# EAGLE board linuxstamp_2_103 (EAGLE 5.06), part 1 of 2
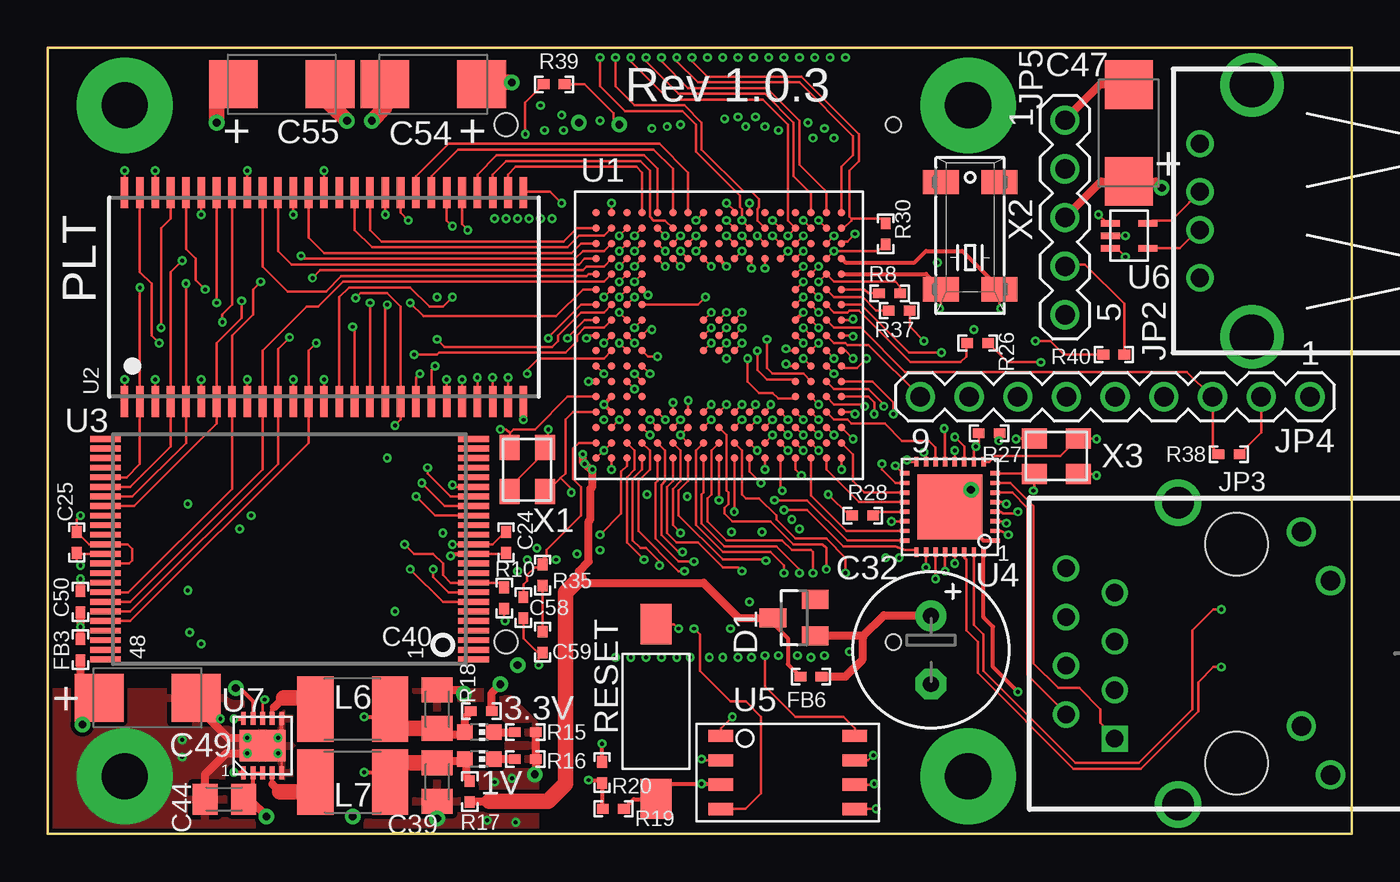
[diagram p2: board, top side]
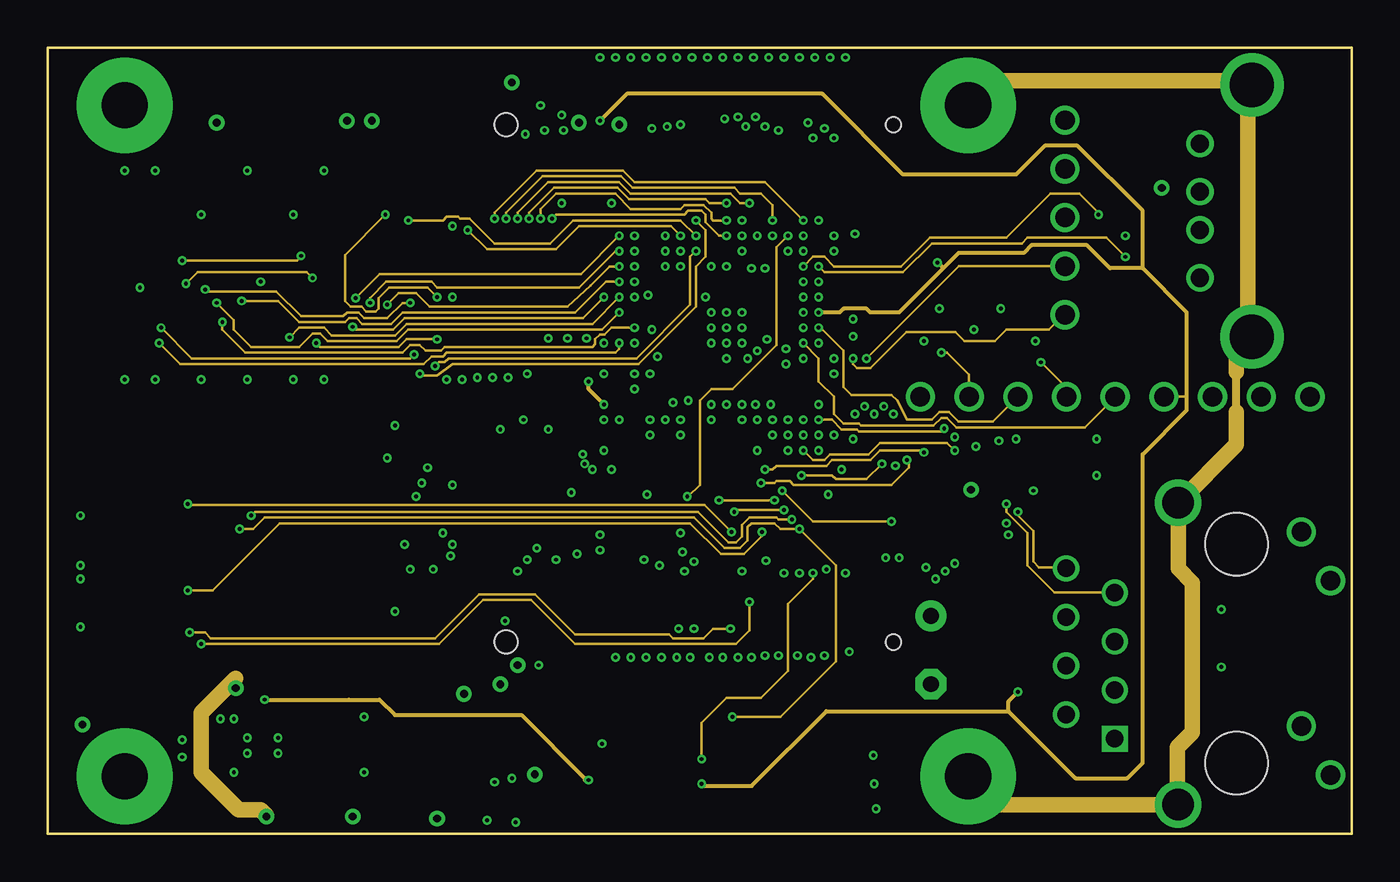
[diagram p3: board, inner layer Route2]
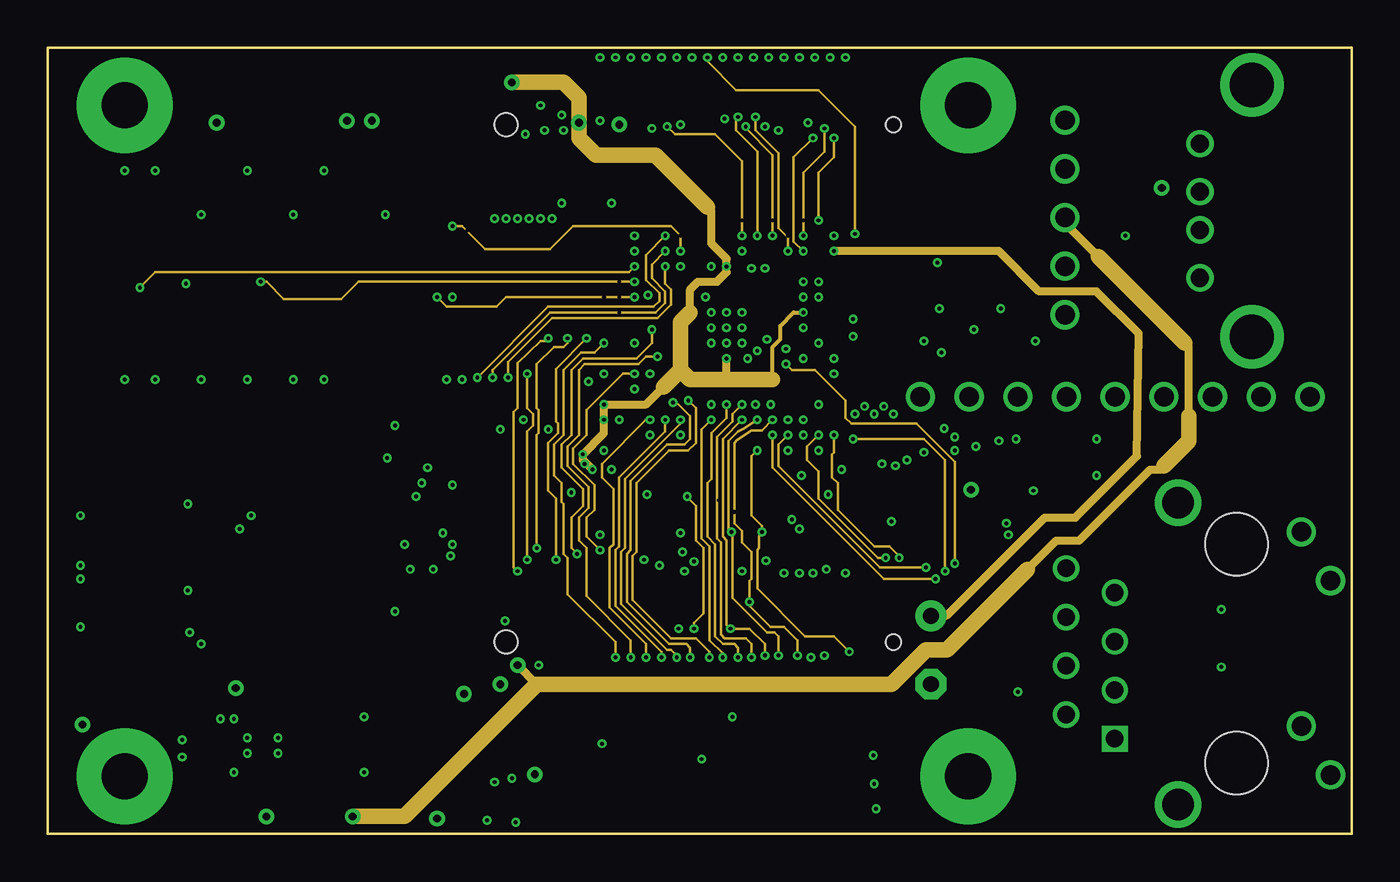
[diagram p4: board, inner layer Route3]
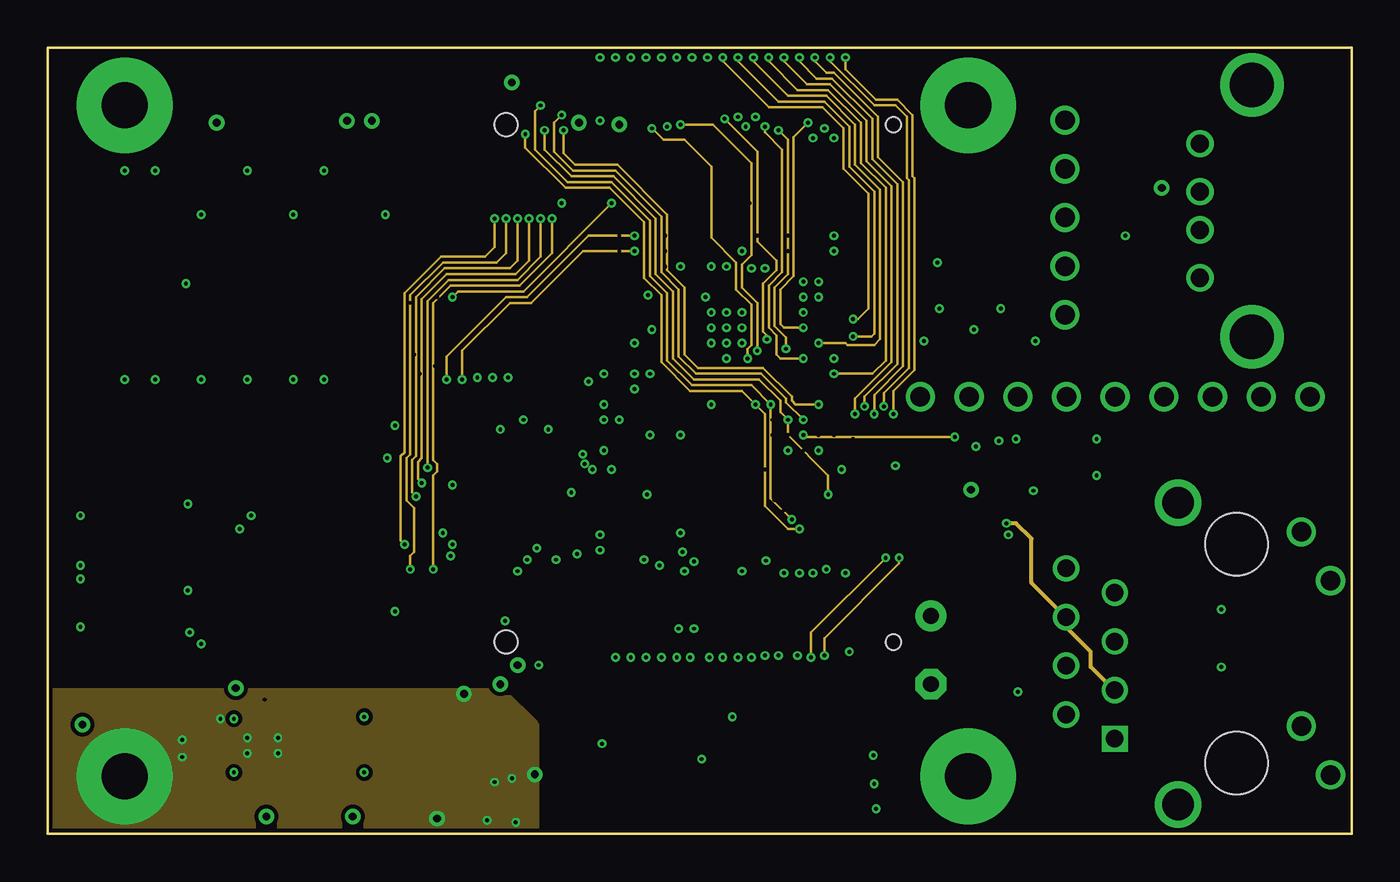
[diagram p5: board, inner layer Route14]
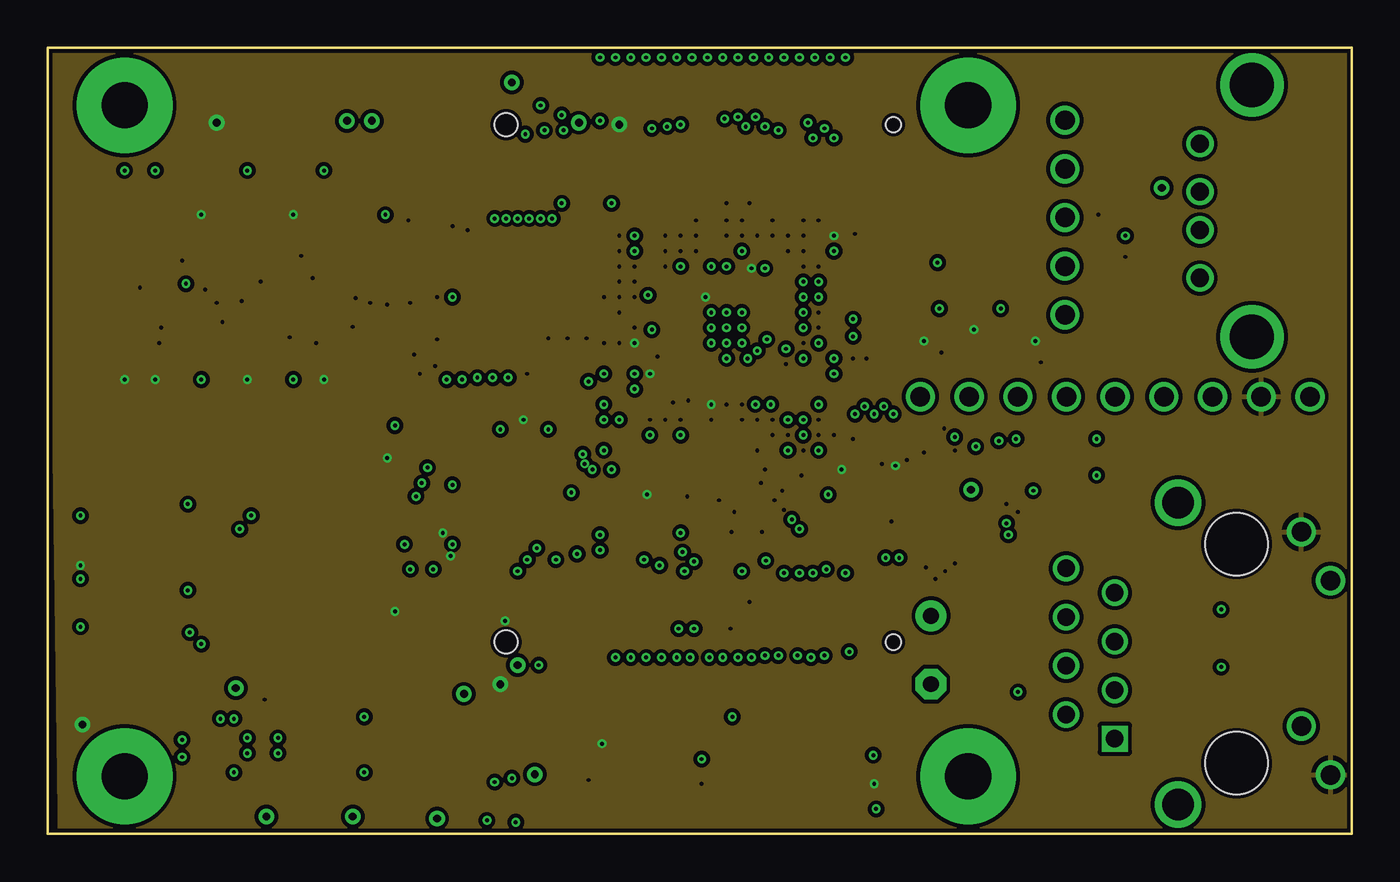
[diagram p6: board, inner layer Route15]
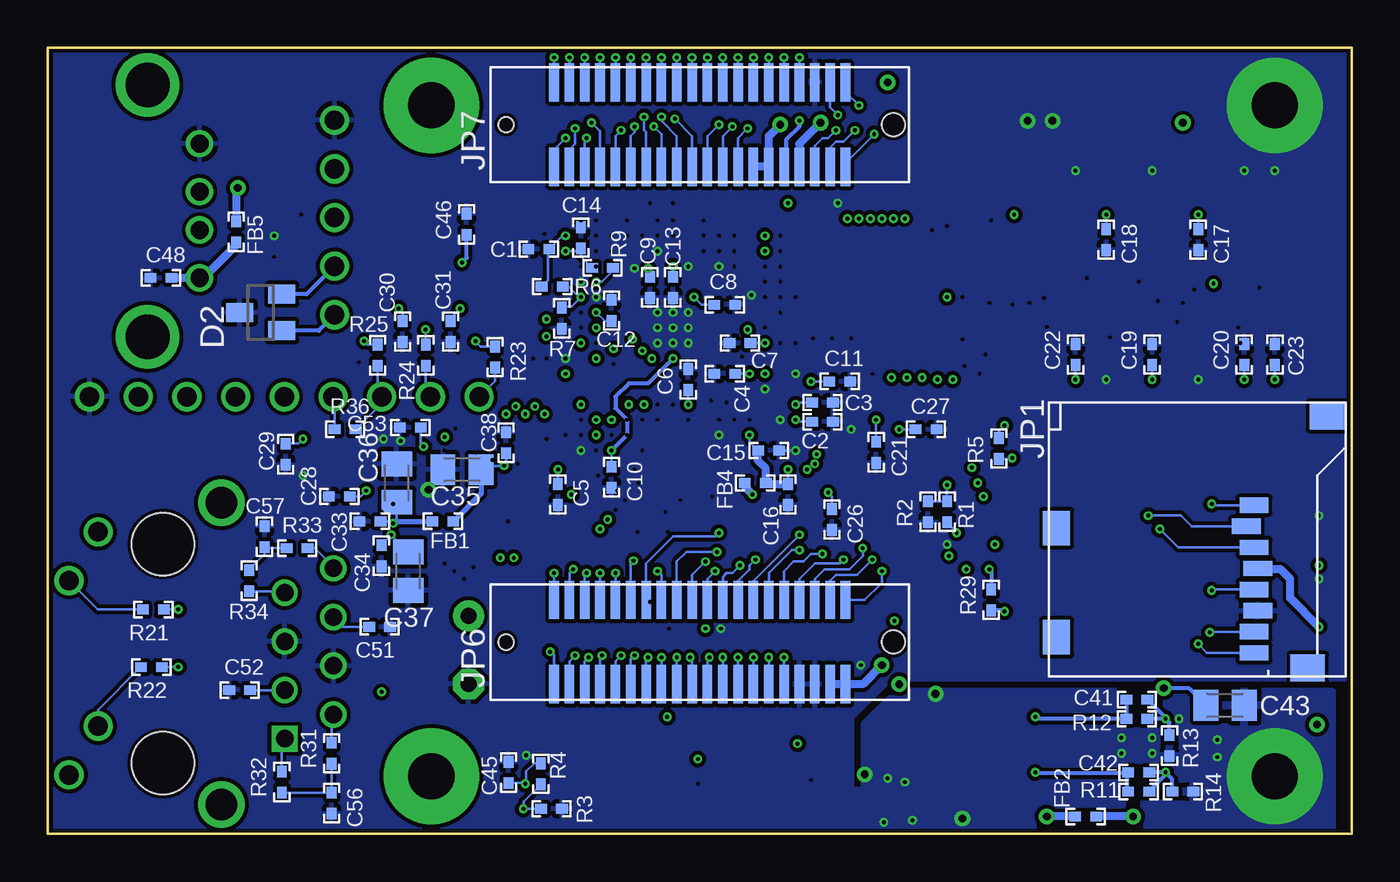
[diagram p7: board, bottom side, seen from below]

Size 68 x 41 mm. Coordinates in mm from the lower left corner, seen from the top.
Outline: 0,0 0,41 68,41 68,0 0,0
Copper layers ([3:1*2*3*14*15*16]): Top 0.035mm / dielectric 0.3048mm / Route2 0.035mm / dielectric 0.3048mm / Route3 0.035mm / dielectric 0.3048mm / Route14 0.035mm / dielectric 0.3048mm / Route15 0.035mm / dielectric 0.3048mm / Bottom 0.035mm
Design rules "default *": minimum track width 5mil, minimum drill 5mil, track to track 5mil, track to pad 5mil, pad to pad 5mil, via to via 5mil, smd to smd 0mil, copper to edge 8mil, drill to drill 8mil, minimum pad ring 5mil, minimum via ring 5mil, stop-mask expansion 2mil, vias tented up to drill 9mil, thermal gap 10mil

## Footprints (pad centres in the part's own frame; a part is rotated, then mirrored left to right if it is on the bottom)
CHIP-LED0603 = smd 0.8 x 0.8: A 0,-0.75; C 0,0.75
0402 = smd 0.61 x 0.51: 1 -0.55,0; 2 0.55,0
E3,5-8 = drill 0.813 pad 1.6 round: + -1.778,0 | drill 0.813 pad 1.6 octagon: - 1.778,0
C0805K = smd 1.3 x 1.6: 1 -1,0; 2 1,0
C/6032-28R = smd 2.55 x 2.5: + 2.525,0; - -2.525,0
SOT23 = smd 1 x 1.4: 1 -0.95,-1.1; 2 0.95,-1.1; 3 0,1.1
CON-MICRO-SD = smd 0.8 x 1.5: 1 5.36,10.7; 2 6.46,10.3; 3 7.56,10.7; 4 8.66,10.9; 5 9.76,10.7; 6 10.86,10.9; 7 11.96,10.7; 8 13.06,10.7 | smd 1.4 x 1.8: M1 0.7,14.5; M2 13.85,13.5 | smd 1.8 x 1.4: M3 12.25,0.4; M4 6.55,0.4
PN87520 = drill 0.95 round: 1 -3.5,2.71; 2 -1,2.71; 3 1,2.71; 4 3.5,2.71 | drill 2.3 round: G1 -6.57,0; G2 6.57,0
PJ-J0 = drill 0.914 square: 1 4.445,-6.35 | drill 0.914 round: 2 3.175,-8.89; 3 1.905,-6.35; 4 0.635,-8.89; 5 -0.635,-6.35; 6 -1.905,-8.89; 7 -3.175,-6.35; 8 -4.445,-8.89 | drill 1.016 round: 9 6.325,4.902; 10 3.785,3.378; 11 -3.81,4.902; 12 -6.35,3.378 | drill 1.626 round: S1 -7.874,-3.048; S2 7.874,-3.048 | hole 3.251: -5.715,0; 5.715,0
MA09-1 = drill 1.016 round: 1 -10.16,0; 2 -7.62,0; 3 -5.08,0; 4 -2.54,0; 5 0,0; 6 2.54,0; 7 5.08,0; 8 7.62,0; 9 10.16,0
MA05-1 = drill 1.016 round: 1 -5.08,0; 2 -2.54,0; 3 0,0; 4 2.54,0; 5 5.08,0
CON-BERGSTACK-40 = smd 0.5 x 2: 1 -7.6,-2.2; 2 -6.8,-2.2; 3 -6,-2.2; 4 -5.2,-2.2; 5 -4.4,-2.2; 6 -3.6,-2.2; 7 -2.8,-2.2; 8 -2,-2.2; 9 -1.2,-2.2; 10 -0.4,-2.2; 11 0.4,-2.2; 12 1.2,-2.2; 13 2,-2.2; 14 2.8,-2.2; 15 3.6,-2.2; 16 4.4,-2.2; 17 5.2,-2.2; 18 6,-2.2; 19 6.8,-2.2; 20 7.6,-2.2; 21 7.6,2.2; 22 6.8,2.2; 23 6,2.2; 24 5.2,2.2; 25 4.4,2.2; 26 3.6,2.2; 27 2.8,2.2; 28 2,2.2; 29 1.2,2.2; 30 0.4,2.2; 31 -0.4,2.2; 32 -1.2,2.2; 33 -2,2.2; 34 -2.8,2.2; 35 -3.6,2.2; 36 -4.4,2.2; 37 -5.2,2.2; 38 -6,2.2; 39 -6.8,2.2; 40 -7.6,2.2 | hole 0.8: -10.1,0 | hole 1.2: 10.1,0
L1812 = smd 1.9 x 3.4: 1 -1.95,0; 2 1.95,0
SWITCH-6X3.5 = smd 2.1 x 1.6: 1 -4.55,0; 2 4.55,0
LFBGA-217 = smd 0.4 x 0.4: A1 -6.4,6.4; A2 -5.6,6.4; A3 -4.8,6.4; A4 -4,6.4; A5 -3.2,6.4; A6 -2.4,6.4; A7 -1.6,6.4; A8 -0.8,6.4; A9 0,6.4; A10 0.8,6.4; A11 1.6,6.4; A12 2.4,6.4; A13 3.2,6.4; A14 4,6.4; A15 4.8,6.4; A16 5.6,6.4; A17 6.4,6.4; B1 -6.4,5.6; B2 -5.6,5.6; B3 -4.8,5.6; B4 -4,5.6; B5 -3.2,5.6; B6 -2.4,5.6; B7 -1.6,5.6; B8 -0.8,5.6; B9 0,5.6; B10 0.8,5.6; B11 1.6,5.6; B12 2.4,5.6; B13 3.2,5.6; B14 4,5.6; B15 4.8,5.6; B16 5.6,5.6; B17 6.4,5.6; C1 -6.4,4.8; C2 -5.6,4.8; C3 -4.8,4.8; C4 -4,4.8; C5 -3.2,4.8; C6 -2.4,4.8; C7 -1.6,4.8; C8 -0.8,4.8; C9 0,4.8; C10 0.8,4.8; C11 1.6,4.8; C12 2.4,4.8; C13 3.2,4.8; C14 4,4.8; C15 4.8,4.8; C16 5.6,4.8; C17 6.4,4.8; D1 -6.4,4; D2 -5.6,4; D3 -4.8,4; D4 -4,4; D5 -3.2,4; D6 -2.4,4; D7 -1.6,4; D8 -0.8,4; D9 0,4; D10 0.8,4; D11 1.6,4; D12 2.4,4; D13 3.2,4; D14 4,4; D15 4.8,4; D16 5.6,4; D17 6.4,4; E1 -6.4,3.2; E2 -5.6,3.2; E3 -4.8,3.2; E4 -4,3.2; E14 4,3.2; E15 4.8,3.2; E16 5.6,3.2; E17 6.4,3.2; F1 -6.4,2.4; F2 -5.6,2.4; F3 -4.8,2.4; F4 -4,2.4; F14 4,2.4; F15 4.8,2.4; F16 5.6,2.4; F17 6.4,2.4; G1 -6.4,1.6; G2 -5.6,1.6; G3 -4.8,1.6; G4 -4,1.6; G14 4,1.6; G15 4.8,1.6; G16 5.6,1.6; G17 6.4,1.6; H1 -6.4,0.8; H2 -5.6,0.8; H3 -4.8,0.8; H4 -4,0.8; H8 -0.8,0.8; H9 0,0.8; H10 0.8,0.8; H14 4,0.8; H15 4.8,0.8; H16 5.6,0.8; H17 6.4,0.8; J1 -6.4,0; J2 -5.6,0; J3 -4.8,0; J4 -4,0; J8 -0.8,0; J9 0,0; J10 0.8,0; J14 4,0; J15 4.8,0; J16 5.6,0; J17 6.4,0; K1 -6.4,-0.8; K2 -5.6,-0.8; K3 -4.8,-0.8; K4 -4,-0.8; K8 -0.8,-0.8; K9 0,-0.8; K10 0.8,-0.8; K14 4,-0.8; K15 4.8,-0.8; K16 5.6,-0.8; K17 6.4,-0.8; L1 -6.4,-1.6; L2 -5.6,-1.6; L3 -4.8,-1.6; L4 -4,-1.6; L14 4,-1.6; L15 4.8,-1.6; L16 5.6,-1.6; L17 6.4,-1.6; M1 -6.4,-2.4; M2 -5.6,-2.4; M3 -4.8,-2.4; M4 -4,-2.4; M14 4,-2.4; M15 4.8,-2.4; M16 5.6,-2.4; M17 6.4,-2.4; N1 -6.4,-3.2; N2 -5.6,-3.2; N3 -4.8,-3.2; N4 -4,-3.2; N14 4,-3.2; N15 4.8,-3.2; N16 5.6,-3.2; N17 6.4,-3.2; P1 -6.4,-4; P2 -5.6,-4; P3 -4.8,-4; P4 -4,-4; P5 -3.2,-4; P6 -2.4,-4; P7 -1.6,-4; P8 -0.8,-4; P9 0,-4; P10 0.8,-4; P11 1.6,-4; P12 2.4,-4; P13 3.2,-4; P14 4,-4; P15 4.8,-4; P16 5.6,-4; P17 6.4,-4; R1 -6.4,-4.8; R2 -5.6,-4.8; R3 -4.8,-4.8; R4 -4,-4.8; R5 -3.2,-4.8; R6 -2.4,-4.8; R7 -1.6,-4.8; R8 -0.8,-4.8; R9 0,-4.8; R10 0.8,-4.8; R11 1.6,-4.8; R12 2.4,-4.8; R13 3.2,-4.8; R14 4,-4.8; R15 4.8,-4.8; R16 5.6,-4.8; R17 6.4,-4.8; T1 -6.4,-5.6; T2 -5.6,-5.6; T3 -4.8,-5.6; T4 -4,-5.6; T5 -3.2,-5.6; T6 -2.4,-5.6; T7 -1.6,-5.6; T8 -0.8,-5.6; T9 0,-5.6; T10 0.8,-5.6; T11 1.6,-5.6; T12 2.4,-5.6; T13 3.2,-5.6; T14 4,-5.6; T15 4.8,-5.6; T16 5.6,-5.6; T17 6.4,-5.6; U1 -6.4,-6.4; U2 -5.6,-6.4; U3 -4.8,-6.4; U4 -4,-6.4; U5 -3.2,-6.4; U6 -2.4,-6.4; U7 -1.6,-6.4; U8 -0.8,-6.4; U9 0,-6.4; U10 0.8,-6.4; U11 1.6,-6.4; U12 2.4,-6.4; U13 3.2,-6.4; U14 4,-6.4; U15 4.8,-6.4; U16 5.6,-6.4; U17 6.4,-6.4
TSOP54 = smd 0.4 x 1.6: 1 -10.4,-5.45; 2 -9.6,-5.45; 3 -8.8,-5.45; 4 -8,-5.45; 5 -7.2,-5.45; 6 -6.4,-5.45; 7 -5.6,-5.45; 8 -4.8,-5.45; 9 -4,-5.45; 10 -3.2,-5.45; 11 -2.4,-5.45; 12 -1.6,-5.45; 13 -0.8,-5.45; 14 0,-5.45; 15 0.8,-5.45; 16 1.6,-5.45; 17 2.4,-5.45; 18 3.2,-5.45; 19 4,-5.45; 20 4.8,-5.45; 21 5.6,-5.45; 22 6.4,-5.45; 23 7.2,-5.45; 24 8,-5.45; 25 8.8,-5.45; 26 9.6,-5.45; 27 10.4,-5.45; 28 10.4,5.45; 29 9.6,5.45; 30 8.8,5.45; 31 8,5.45; 32 7.2,5.45; 33 6.4,5.45; 34 5.6,5.45; 35 4.8,5.45; 36 4,5.45; 37 3.2,5.45; 38 2.4,5.45; 39 1.6,5.45; 40 0.8,5.45; 41 0,5.45; 42 -0.8,5.45; 43 -1.6,5.45; 44 -2.4,5.45; 45 -3.2,5.45; 46 -4,5.45; 47 -4.8,5.45; 48 -5.6,5.45; 49 -6.4,5.45; 50 -7.2,5.45; 51 -8,5.45; 52 -8.8,5.45; 53 -9.6,5.45; 54 -10.4,5.45
TSOP48 = smd 0.3 x 1.6: 1 -5.75,-9.6; 2 -5.25,-9.6; 3 -4.75,-9.6; 4 -4.25,-9.6; 5 -3.75,-9.6; 6 -3.25,-9.6; 7 -2.75,-9.6; 8 -2.25,-9.6; 9 -1.75,-9.6; 10 -1.25,-9.6; 11 -0.75,-9.6; 12 -0.25,-9.6; 13 0.25,-9.6; 14 0.75,-9.6; 15 1.25,-9.6; 16 1.75,-9.6; 17 2.25,-9.6; 18 2.75,-9.6; 19 3.25,-9.6; 20 3.75,-9.6; 21 4.25,-9.6; 22 4.75,-9.6; 23 5.25,-9.6; 24 5.75,-9.6; 25 5.75,9.6; 26 5.25,9.6; 27 4.75,9.6; 28 4.25,9.6; 29 3.75,9.6; 30 3.25,9.6; 31 2.75,9.6; 32 2.25,9.6; 33 1.75,9.6; 34 1.25,9.6; 35 0.75,9.6; 36 0.25,9.6; 37 -0.25,9.6; 38 -0.75,9.6; 39 -1.25,9.6; 40 -1.75,9.6; 41 -2.25,9.6; 42 -2.75,9.6; 43 -3.25,9.6; 44 -3.75,9.6; 45 -4.25,9.6; 46 -4.75,9.6; 47 -5.25,9.6; 48 -5.75,9.6
MLF32 = smd 0.5 x 0.23: 1 -2.35,1.75; 2 -2.35,1.25; 3 -2.35,0.75; 4 -2.35,0.25; 5 -2.35,-0.25; 6 -2.35,-0.75; 7 -2.35,-1.25; 8 -2.35,-1.75; 17 2.35,-1.75; 18 2.35,-1.25; 19 2.35,-0.75; 20 2.35,-0.25; 21 2.35,0.25; 22 2.35,0.75; 23 2.35,1.25; 24 2.35,1.75 | smd 0.23 x 0.5: 9 -1.75,-2.35; 10 -1.25,-2.35; 11 -0.75,-2.35; 12 -0.25,-2.35; 13 0.25,-2.35; 14 0.75,-2.35; 15 1.25,-2.35; 16 1.75,-2.35; 25 1.75,2.35; 26 1.25,2.35; 27 0.75,2.35; 28 0.25,2.35; 29 -0.25,2.35; 30 -0.75,2.35; 31 -1.25,2.35; 32 -1.75,2.35 | smd 3.4 x 3.4: 33 0,0
CASON-8 = smd 1.27 x 0.635: 1 -3.5,1.905; 2 -3.5,0.635; 3 -3.5,-0.635; 4 -3.5,-1.905; 5 3.485,-1.905; 6 3.485,-0.635; 7 3.485,0.635; 8 3.485,1.905
SOT323-5 = smd 0.35 x 1: 1 0.65,0.975; 2 0,0.975; 3 -0.65,0.975; 4 -0.65,-0.975; 5 0.65,-0.975
DFN-10 = smd 0.25 x 0.675: 1 -1,-1.413; 2 -0.5,-1.413; 3 0,-1.413; 4 0.5,-1.413; 5 1,-1.413; 6 1,1.413; 7 0.5,1.413; 8 0,1.413; 9 -0.5,1.413; 10 -1,1.413 | smd 2.38 x 1.65: 11 0,0
CRYSTAL-3.2-2.5 = smd 1.3 x 1.05: 1 -1.15,-0.925; 2 1.15,-0.925; 3 1.15,0.925; 4 -1.15,0.925
MM20SS = smd 1.27 x 1.88: 1 -2.794,-1.524; 2 2.794,-1.524; 3 2.794,1.524; 4 -2.794,1.524

## Placement (x,y rotation side)
1V  [CHIP-LED0603]  22.5,3.9 270 top
3.3V  [CHIP-LED0603]  22.5,5.3 270 top
C1  0.1uF  [0402]  42.4,30.5 180 bottom
C2  0.1uF  [0402]  27.6,21.5 0 bottom
C3  0.1uF  [0402]  27.6,22.5 0 bottom
C4  0.1uF  [0402]  32.7,24 180 bottom
C5  0.1uF  [0402]  41.4,17.7 270 bottom
C6  0.1uF  [0402]  34.6,23.7 90 bottom
C7  0.1uF  [0402]  31.9,25.6 180 bottom
C8  0.1uF  [0402]  32.7,27.6 0 bottom
C9  0.1uF  [0402]  36.6,28.5 270 bottom
C10  0.1uF  [0402]  38.6,18.6 270 bottom
C11  0.1uF  [0402]  26.7,23.6 0 bottom
C12  0.1uF  [0402]  38.6,27.3 90 bottom
C13  0.1uF  [0402]  35.4,28.5 270 bottom
C14  0.1uF  [0402]  40.2,31.1 90 bottom
C15  0.1uF  [0402]  30.4,20 0 bottom
C16  0.1uF  [0402]  29.4,17.7 270 bottom
C17  0.1uF  [0402]  8,31 270 bottom
C18  0.1uF  [0402]  12.8,31 270 bottom
C19  0.1uF  [0402]  10.4,25 90 bottom
C20  0.1uF  [0402]  5.6,25 90 bottom
C21  0.1uF  [0402]  24.8,19.9 270 bottom
C22  0.1uF  [0402]  14.4,25 90 bottom
C23  0.1uF  [0402]  4,25 90 bottom
C24  0.1uF  [0402]  23.9,15.2 90 top
C25  0.1uF  [0402]  1.5,15.2 90 top
C26  18pF  [0402]  27.1,16.4 270 bottom
C27  18pF  [0402]  22.2,21.1 0 bottom
C28  18pF  [0402]  52.8,17.6 180 bottom
C29  18pF  [0402]  55.6,19.8 270 bottom
C30  12.5pF  [0402]  49.5,26.2 270 bottom
C31  12.5pF  [0402]  47,26.2 270 bottom
C32  [E3,5-8]  46.06,9.59 270 top
C33  0.1uF  [0402]  51.2,16.3 180 bottom
C34  0.1uF  [0402]  50.6,14.5 90 bottom
C35  22uF  [C0805K]  46.4,19 180 bottom
C36  22uF  [C0805K]  49.8,18.3 90 bottom
C37  22uF  [C0805K]  49.2,13.7 90 bottom
C38  0.1uF  [0402]  44.1,20.4 90 bottom
C39  10uF  [C0805K]  20.3,2.7 270 top
C40  10uF  [C0805K]  20.3,6.5 90 top
C41  22pF  [0402]  11.2,7 180 bottom
C42  22pF  [0402]  11.1,3.2 0 bottom
C43  10uF  [C0805K]  6.6,6.7 0 bottom
C44  10uF  [C0805K]  9.2,1.8 180 top
C45  0.1uF  [0402]  43.97,3.2 90 bottom
C46  1nF  [0402]  46.16,31.8 90 bottom
C47  100uF  [C/6032-28R]  56.38,36.56 270 top
C48  0.1uF  [0402]  62.1,29 0 bottom
C49  100uF  [C/6032-28R]  5.2,7.1 180 top
C50  0.1uF  [0402]  1.7,12.1 270 top
C51  0.1uF  [0402]  50.7,10.8 180 bottom
C52  0.1uF  [0402]  58,7.5 0 bottom
C53  100pF  [0402]  49.1,21.2 180 bottom
C54  100uF  [C/6032-28R]  20.1,39.1 0 top
C55  100uF  [C/6032-28R]  12.2,39.1 180 top
C56  0.1uF  [0402]  53.2,1.6 270 bottom
C57  0.1uF  [0402]  56.7,15.5 90 bottom
C58  1nF  [0402]  24.8,11.8 90 top
C59  10nF  [0402]  25.8,10 90 top
D1  [SOT23]  38.92,11.27 90 top
D2  [SOT23]  56.9,27.2 90 bottom
FB1  [0402]  47.4,16.3 180 bottom
FB2  [0402]  13.87,0.9 0 bottom
FB3  [0402]  1.7,9.6 270 top
FB4  [0402]  31.1,18.3 0 bottom
FB5  [0402]  58.18,31.4 90 bottom
FB6  [0402]  39.8,8.2 180 top
JP1  CON-SD  [CON-MICRO-SD]  15.79,22.5 270 bottom
JP2  [PN87520]  62.8,32.5 90 top
JP3  J0026  [PJ-J0]  62,9.4 270 top
JP4  [MA09-1]  55.67,22.8 180 top
JP5  [MA05-1]  53.05,32.15 270 top
JP6  CON-FCI-40  [CON-BERGSTACK-40]  34,10 0 bottom
JP7  CON-FCI-40  [CON-BERGSTACK-40]  34,37 0 bottom
L6  2.2uH  [L1812]  15.9,6.5 180 top
L7  2.2uH  [L1812]  15.9,2.7 0 top
R1  470k  [0402]  21.1,16.8 90 bottom
R2  NP  [0402]  22.1,16.8 90 bottom
R3  NP  [0402]  41.73,1.3 180 bottom
R4  470k  [0402]  42.29,3.13 90 bottom
R5  470k  [0402]  18.4,20.1 90 bottom
R6  470k  [0402]  41.7,28.55 180 bottom
R7  NP  [0402]  41.2,26.9 90 bottom
R8  1k  [0402]  43.9,28.2 180 top
R9  10k  [0402]  39.07,29.52 0 bottom
R10  470k  [0402]  23.8,12.3 90 top
R11  442k  [0402]  11.1,2.2 180 bottom
R12  887k  [0402]  11.2,6 0 bottom
R13  197k  [0402]  9.5,4.6 90 bottom
R14  665k  [0402]  8.8,2.2 180 bottom
R15  200  [0402]  24.9,5.3 180 top
R16  200  [0402]  24.9,3.9 180 top
R17  0  [0402]  22,2.2 270 top
R18  0  [0402]  22.6,6.4 180 top
R19  10k  [0402]  29.5,1.3 0 top
R20  100k  [0402]  28.9,3.2 90 top
R21  200  [0402]  62.5,11.7 180 bottom
R22  200  [0402]  62.6,8.7 180 bottom
R23  100k  [0402]  44.68,24.87 270 bottom
R24  100k  [0402]  48.29,24.97 270 bottom
R25  100k  [0402]  50.8,24.97 270 bottom
R26  [0402]  48.5,25.6 180 top
R27  6.49k  [0402]  49.1,20.9 180 top
R28  0  [0402]  42.5,16.6 0 top
R29  1k  [0402]  18.8,12.2 90 bottom
R30  100k  [0402]  43.7,31.3 90 top
R31  49.9  [0402]  53.2,4.2 90 bottom
R32  49.9  [0402]  55.8,2.7 90 bottom
R33  49.9  [0402]  55,14.9 0 bottom
R34  49.9  [0402]  57.5,13.2 270 bottom
R35  1k  [0402]  25.8,13.5 90 top
R36  [0402]  52.5,21.1 0 bottom
R37  [0402]  44.4,27.3 0 top
R38  100k  [0402]  61.6,19.8 180 top
R39  10k  [0402]  26.4,39.1 0 top
R40  10k  [0402]  55.6,25 180 top
RESET  SWITCH-PUSHBUTTON-6X3.5  [SWITCH-6X3.5]  31.72,6.38 90 top
U1  AT91SAM9G20  [LFBGA-217]  35,26 0 top
U2  K4S561632E-TC60/75  [TSOP54]  14.4,28 0 top
U3  IC-X8-NAND  [TSOP48]  12.6,14.85 90 top
U4  IC-PHY-KSZ8041-NL  [MLF32]  47.05,17.05 180 top
U5  DATAFLASH-8  [CASON-8]  38.6,3.2 0 top
U6  USBDF01W5  [SOT323-5]  56.4,31.2 90 top
U7  PS-LTC3407-3  [DFN-10]  11.2,4.6 0 top
X1  18.432  [CRYSTAL-3.2-2.5]  25,19 270 top
X2  32.768khz  [MM20SS]  48.1,31.2 90 top
X3  25.000  [CRYSTAL-3.2-2.5]  52.6,19.7 0 top